# EAGLE design R6DroneElectronics (EAGLE 9.7.0)
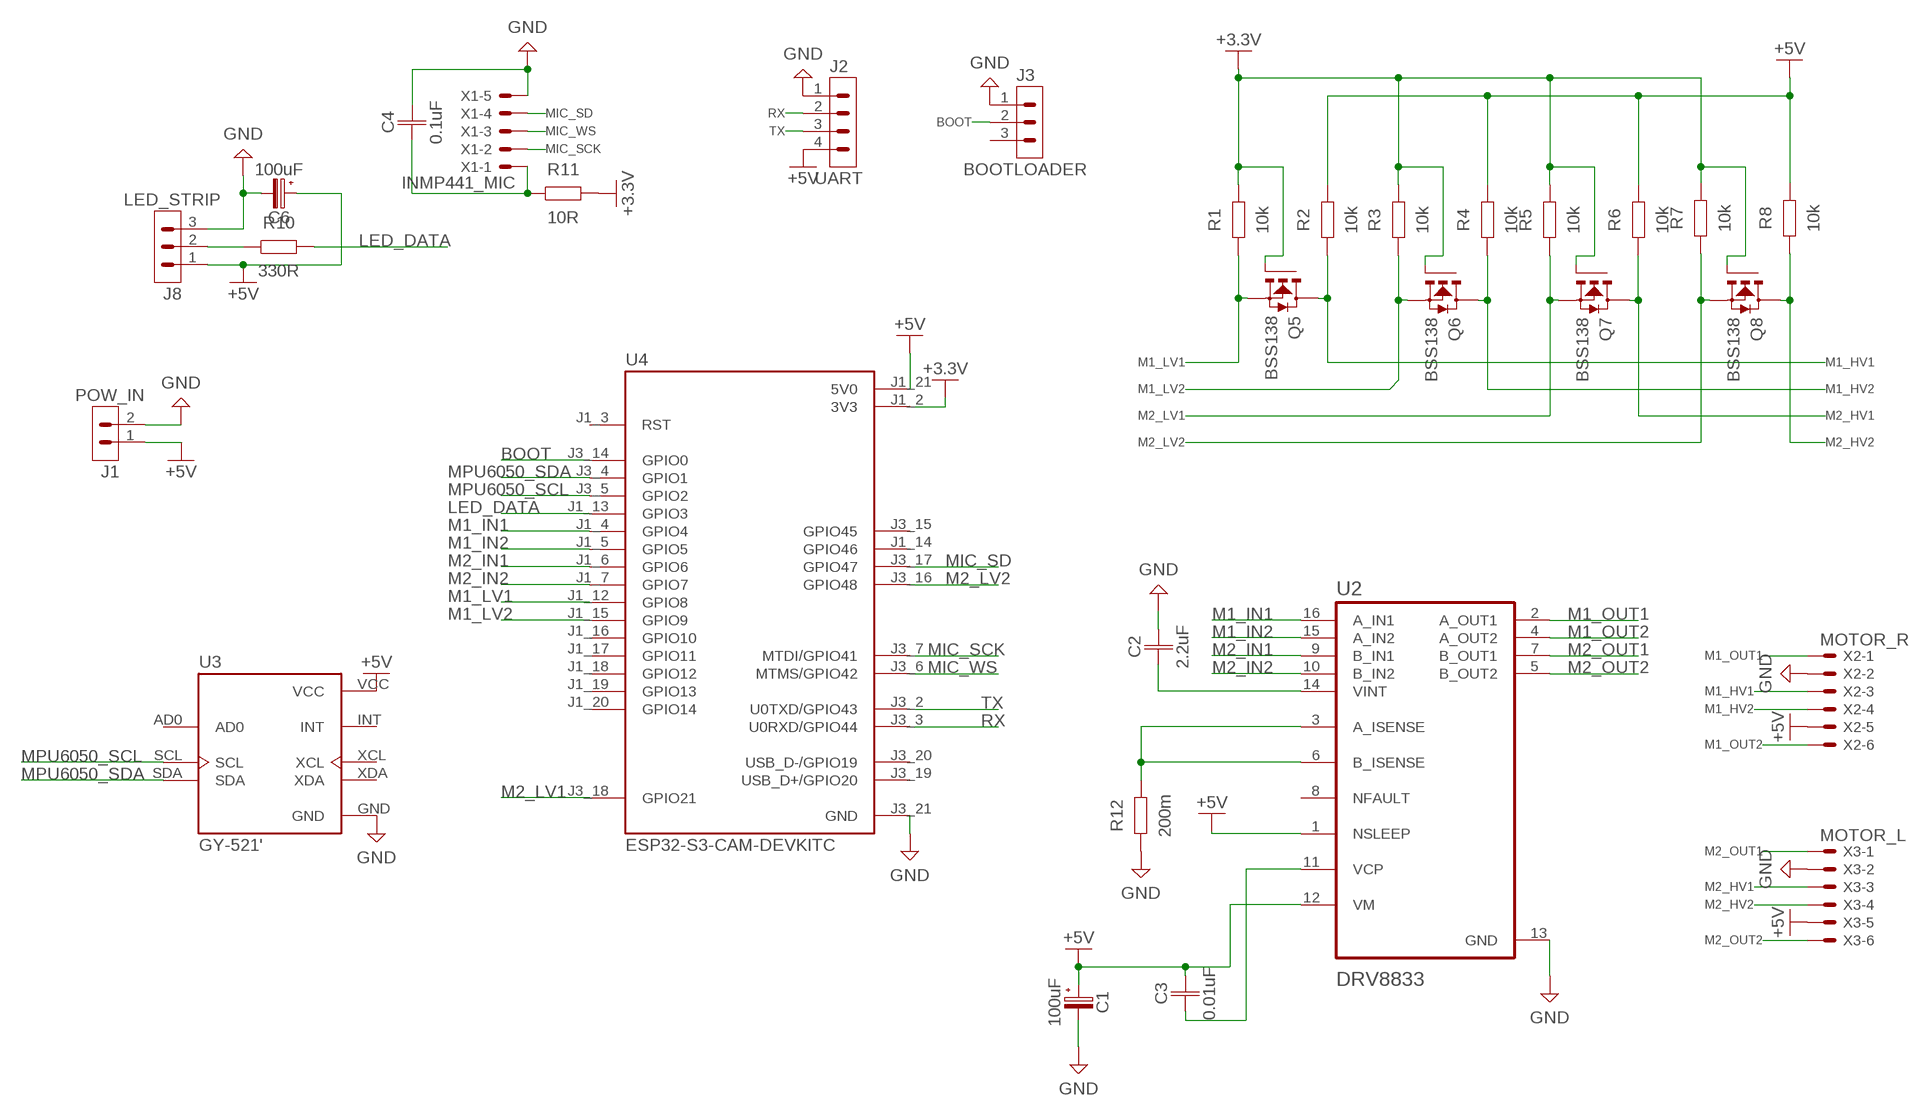
[diagram p0: schematic, sheet 1]

## Parts
C1  100uF  C-POL_ECAP-10.5MM  [CAPAE1030X1050N]
C2  2.2uF  C_CHIP-1812(4532-METRIC)  [CAPC4532X135]
C3  0.01uF  C_CHIP-1812(4532-METRIC)  [CAPC4532X135]
C4  0.1uF  C_CHIP-1812(4532-METRIC)  [CAPC4532X135]
C6  100uF  C-POL_ECAP-10.5MM  [CAPAE1030X1050N]
J1  POW_IN  B2B-XH-A  [B2B-XH-A]
J2  UART  B4B-XH-A  [B4B-XH-A]
J3  BOOTLOADER  B3B-XH-A  [B3B-XH-A]
J8  LED_STRIP  B3B-XH-A  [B3B-XH-A]
Q5  BSS138  NMOSFET_BSS123_SOT23-GSD  [SOT23]
Q6  BSS138  NMOSFET_BSS123_SOT23-GSD  [SOT23]
Q7  BSS138  NMOSFET_BSS123_SOT23-GSD  [SOT23]
Q8  BSS138  NMOSFET_BSS123_SOT23-GSD  [SOT23]
R1  10k  R_CHIP-1210(3225-METRIC)  [RESC3224X71]
R2  10k  R_CHIP-1210(3225-METRIC)  [RESC3224X71]
R3  10k  R_CHIP-1210(3225-METRIC)  [RESC3224X71]
R4  10k  R_CHIP-1210(3225-METRIC)  [RESC3224X71]
R5  10k  R_CHIP-1210(3225-METRIC)  [RESC3224X71]
R6  10k  R_CHIP-1210(3225-METRIC)  [RESC3224X71]
R7  10k  R_CHIP-1210(3225-METRIC)  [RESC3224X71]
R8  10k  R_CHIP-1210(3225-METRIC)  [RESC3224X71]
R10  330R  R_CHIP-1210(3225-METRIC)  [RESC3224X71]
R11  10R  R_CHIP-1210(3225-METRIC)  [RESC3224X71]
R12  200m  R_CHIP-1210(3225-METRIC)  [RESC3224X71]
U2  DRV8833  DRV8833PW  [SOP65P640X120-16N]
U3  GY-521'  [MODULE_GY-521]
U4  ESP32-S3-CAM-DEVKITC  [ESP32-S3-CAM-DEVKITC]
X1  INMP441_MIC  JST-XH-05-PIN-LONG-PAD  [JST-XH-05-PACKAGE-LONG-PAD]
X2  MOTOR_R  JST-XH-06-PIN-LONG-PAD  [JST-XH-06-PACKAGE-LONG-PAD]
X3  MOTOR_L  JST-XH-06-PIN-LONG-PAD  [JST-XH-06-PACKAGE-LONG-PAD]

## Nets
+3.3V: Q5.1(G) Q6.1(G) Q7.1(G) Q8.1(G) R1.2 R3.2 R5.2 R7.2 R11.2 U4.J1_2(3V3)
+5V: C1.1(+) C3.2 C6.1(+) J1.1 J2.4 J8.1 R2.2 R4.2 R6.2 R8.2 U2.1(NSLEEP) U2.12(VM) U3.VCC U4.J1_21(5V0) X2.5 X3.5
BOOT: J3.2 U4.J3_14(GPIO0)
GND: C1.2(-) C2.2 C4.2 C6.2(-) J1.2 J2.1 J3.1 J8.3 R12.1 U2.13(GND) U3.GND U4.J3_21(GND) X1.5 X2.2 X3.2
LED_DATA: R10.2 U4.J1_13(GPIO3)
M1_HV1: Q5.3(D) R2.1 X2.3
M1_HV2: Q6.3(D) R4.1 X2.4
M1_IN1: U2.16(A_IN1) U4.J1_4(GPIO4)
M1_IN2: U2.15(A_IN2) U4.J1_5(GPIO5)
M1_LV1: Q5.2(S) R1.1 U4.J1_12(GPIO8)
M1_LV2: Q6.2(S) R3.1 U4.J1_15(GPIO9)
M1_OUT1: U2.2(A_OUT1) X2.1
M1_OUT2: U2.4(A_OUT2) X2.6
M2_HV1: Q7.3(D) R6.1 X3.3
M2_HV2: Q8.3(D) R8.1 X3.4
M2_IN1: U2.9(B_IN1) U4.J1_6(GPIO6)
M2_IN2: U2.10(B_IN2) U4.J1_7(GPIO7)
M2_LV1: Q7.2(S) R5.1 U4.J3_18(GPIO21)
M2_LV2: Q8.2(S) R7.1 U4.J3_16(GPIO48)
M2_OUT1: U2.7(B_OUT1) X3.1
M2_OUT2: U2.5(B_OUT2) X3.6
MIC_SCK: U4.J3_7(MTDI/GPIO41) X1.2
MIC_SD: U4.J3_17(GPIO47) X1.4
MIC_WS: U4.J3_6(MTMS/GPIO42) X1.3
MPU6050_SCL: U3.SCL U4.J3_5(GPIO2)
MPU6050_SDA: U3.SDA U4.J3_4(GPIO1)
N$1: J8.2 R10.1
N$2: C2.1 U2.14(VINT)
N$3: R12.2 U2.3(A_ISENSE) U2.6(B_ISENSE)
N$5: C3.1 U2.11(VCP)
N$27: C4.1 R11.1 X1.1
RX: J2.2 U4.J3_3(U0RXD/GPIO44)
TX: J2.3 U4.J3_2(U0TXD/GPIO43)
Unconnected: J3.3 U2.8(NFAULT) U3.AD0 U3.INT U3.XCL U3.XDA U4.J1_3(RST) U4.J1_14(GPIO46) U4.J1_16(GPIO10) U4.J1_17(GPIO11) U4.J1_18(GPIO12) U4.J1_19(GPIO13) U4.J1_20(GPIO14) U4.J3_15(GPIO45) U4.J3_19(USB_D+/GPIO20) U4.J3_20(USB_D-/GPIO19)

## Library data of the parts
C1 C6 = Capacitor:C-POL: Capacitor Polarised - Generic; CATEGORY_L1: Capacitor; CATEGORY_L2: Aluminum Electrolytic Capacitors; CATEGORY_L3: Radial Can; PACKAGE: Surface Mount; PACKAGE_SIZE: 10.5MM
C2-C4 = Capacitor:C: Capacitor - Generic; CATEGORY_L1: Capacitor; CATEGORY_L2: Ceramic Capacitors; CATEGORY_L3: MLCC; PACKAGE: Surface Mount; PACKAGE_SIZE: 1812
J1 = Connector:B2B-XH-A: XH Connector Top Entry - 2POS; CATEGORY_L1: Connectors; CATEGORY_L2: Rectangular Connectors; CATEGORY_L3: Male Headers; DATASHEET: https://www.jst-mfg.com/product/pdf/eng/eXH.pdf; DESCRIPTION: Connector Header Through Hole 2 position 0.098" (2.50mm); MANUFACTURER: JST Sales America Inc.; MPN: B2B-XH-A; OPERATING_TEMPERATURE: -25°C ~ 85°C; PACKAGE: Through Hole; PACKAGE_SIZE: NA; PART_STATUS: Active; PITCH: 0.098" (2.50mm); ROHS: Compliant; SERIES: XH
J2 = Connector:B4B-XH-A: XH Connector Top Entry - 4POS; CATEGORY_L1: Connectors; CATEGORY_L2: Rectangular Connectors; CATEGORY_L3: Male Headers; DATASHEET: https://www.jst-mfg.com/product/pdf/eng/eXH.pdf; DESCRIPTION: Connector Header Through Hole 4 position 0.098" (2.50mm); MANUFACTURER: JST Sales America Inc.; MPN: B4B-XH-A; OPERATING_TEMPERATURE: -25°C ~ 85°C; PACKAGE: Through Hole; PACKAGE_SIZE: NA; PART_STATUS: Active; PITCH: 0.098" (2.50mm); ROHS: Compliant; SERIES: XH
J3 J8 = Connector:B3B-XH-A: XH Connector Top Entry - 3POS; CATEGORY_L1: Connectors; CATEGORY_L2: Rectangular Connectors; CATEGORY_L3: Male Headers; DATASHEET: https://www.jst-mfg.com/product/pdf/eng/eXH.pdf; DESCRIPTION: Connector Header Through Hole 3 position 0.098" (2.50mm); MANUFACTURER: JST Sales America Inc.; MPN: B3B-XH-A; OPERATING_TEMPERATURE: -25°C ~ 85°C; PACKAGE: Through Hole; PACKAGE_SIZE: NA; PART_STATUS: Active; PITCH: 0.098" (2.50mm); ROHS: Compliant; SERIES: XH
Q5-Q8 = Transistor:NMOSFET_: N-Channel MOSFET - Popular parts; CATEGORY_L1: Transistor; CATEGORY_L2: MOSFET; CATEGORY_L3: N-Channel; DATASHEET: https://www.onsemi.com/download/data-sheet/pdf/bss123l-d.pdf; DESCRIPTION: N-Channel 100 V 170mA (Ta) 360mW (Ta) Surface Mount SOT-23-3; DRAIN_CURRENT: 170 mA; IC_MAX: NA; MANUFACTURER: onsemi; MPN: BSS123L; OPERATING_TEMPERATURE: -55°C ~ 150°C; PACKAGE: Surface Mount; PACKAGE_SIZE: SOT-23-3; PART_STATUS: Active; ROHS: Compliant; SERIES: BSS123; THERMALLOSS: 0.36 W; VCEO_MAX: NA
R1-R8 R10-R12 = Resistor:R: Resistor Fixed - Generic; CATEGORY_L1: Resistors; DESCRIPTION: Chip Resistor 3.20 X 2.49 X 0.71 mm body 1210(3225-METRIC) Package; PACKAGE: Surface Mount; PACKAGE_SIZE: 1210
U2 = DRV8833:DRV8833PW; CHECK_PRICES: https://www.snapeda.com/parts/DRV8833PW/Texas+Instruments/view-part/?ref=eda; DESCRIPTION: 10.8-V, 2-A dual H-bridge motor driver with current regulation; DIGIKEY_PART_NUMBER: DRV8833PW-ND; MF: Texas Instruments; MP: DRV8833PW; PACKAGE: TSSOP-16 Texas Instruments; SNAPEDA_LINK: https://www.snapeda.com/parts/DRV8833PW/Texas+Instruments/view-part/?ref=snap
U3 = GY-521:GY-521; AVAILABILITY: Not in stock; CHECK_PRICES: https://www.snapeda.com/parts/GY-521/GODREAM+FORDREAM+CO.%252C+LIMITED/view-part/?ref=eda; DESCRIPTION: Triple Axis Accelerometer Gyro Breakout; MF: GODREAM FORDREAM CO., LIMITED; MP: GY-521; PACKAGE: Package; PRICE: None; SNAPEDA_LINK: https://www.snapeda.com/parts/GY-521/GODREAM+FORDREAM+CO.%252C+LIMITED/view-part/?ref=snap
U4 = ESP32-S3-CAM-DEVKITC:ESP32-S3-CAM-DEVKITC; AVAILABILITY: In Stock; CHECK_PRICES: https://www.snapeda.com/parts/ESP32-S3-DEVKITC-1-N8R2/Espressif+Systems/view-part/?ref=eda; DESCRIPTION: WiFi Development Tools - 802.11 ESP32-S3 general-purpose development board, embeds ESP32-S3-WROOM-1-N8R2, with pin header; MF: Espressif Systems; MP: ESP32-S3-DEVKITC-1-N8R2; PACKAGE: None; PRICE: None; SNAPEDA_LINK: https://www.snapeda.com/parts/ESP32-S3-DEVKITC-1-N8R2/Espressif+Systems/view-part/?ref=snap
X1 = Rembrandt Electronics - JST XH Connectors v1-0:JST-XH-05-PIN: JST XH Connector 2 Pin Wire to board connector. Pitch: 2,54 mm, (0.100") Number of pins: 5 Created by Rembrandt Electronics www.rembrandtelectronics.com
X2 X3 = Rembrandt Electronics - JST XH Connectors v1-0:JST-XH-06-PIN: JST XH Connector 2 Pin Wire to board connector. Pitch: 2,54 mm, (0.100") Number of pins: 6 Created by Rembrandt Electronics www.rembrandtelectronics.com

## Board
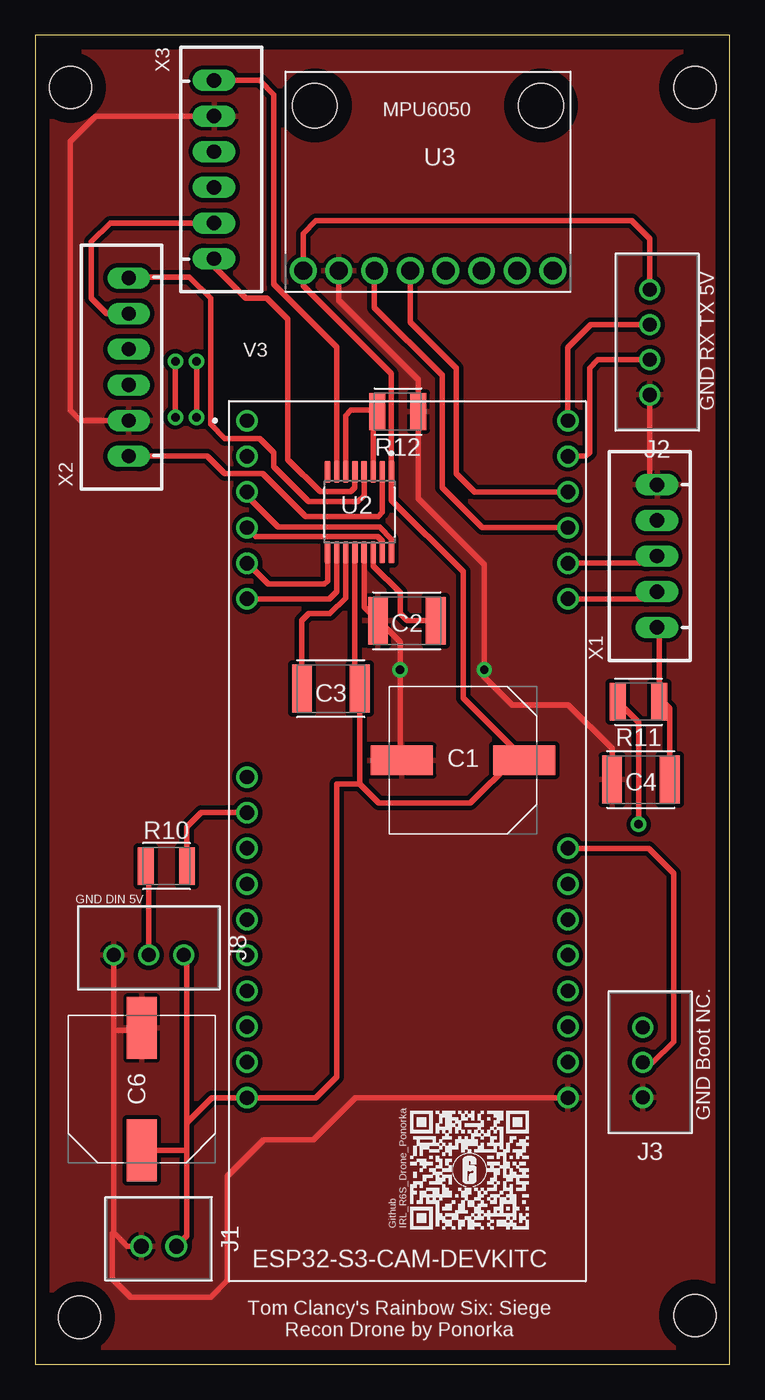
[diagram p1: board, top side]
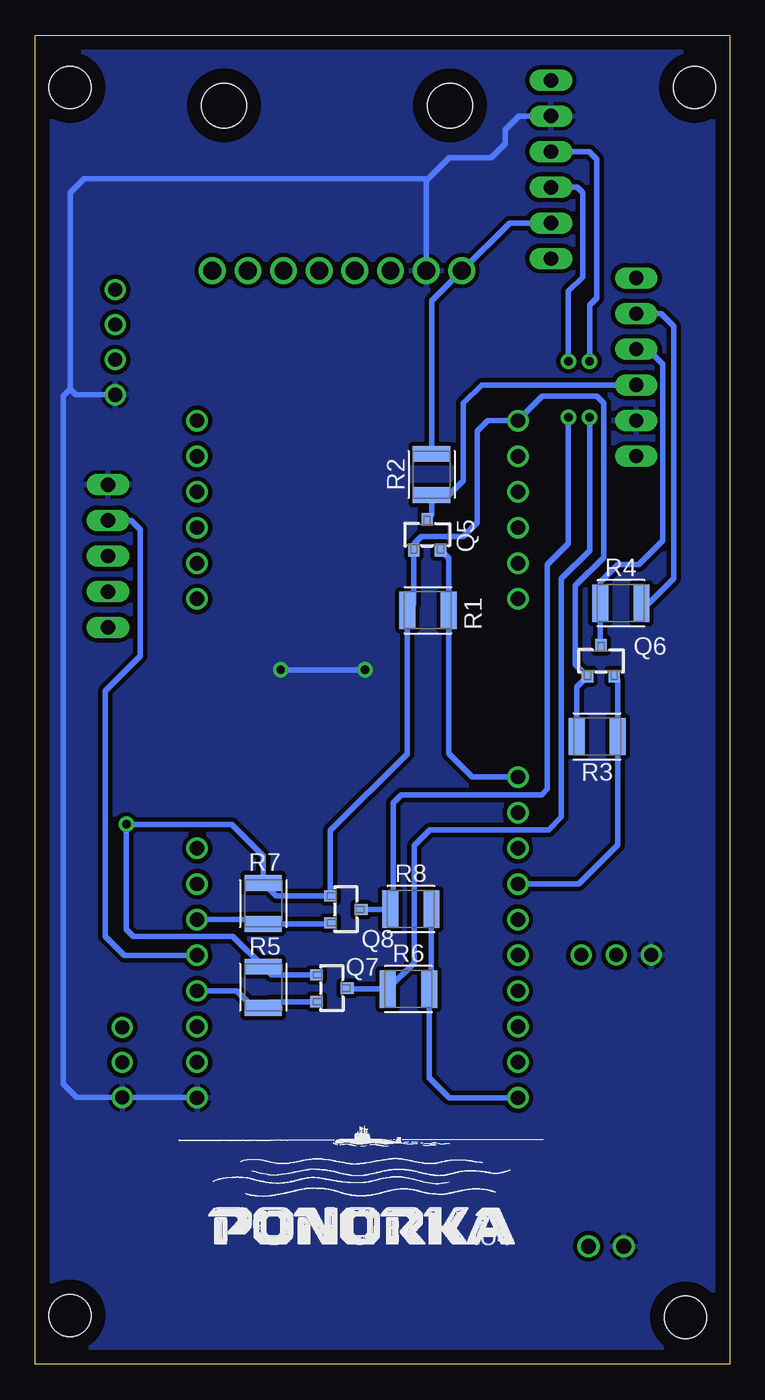
[diagram p2: board, bottom side, seen from below]

Size 49.5 x 94.74 mm. Coordinates in mm from the lower left corner, seen from the top.
Outline: 0,0 49.5,0 49.5,94.74 0,94.74 0,0
Copper layers (1*16): Top 0.035mm / dielectric 1.5mm / Bottom 0.035mm
Design rules "Fusion Electronics Design Rules": minimum track width 6mil, minimum drill 0.35mm, track to track 6mil, track to pad 6mil, pad to pad 6mil, via to via 6mil, smd to smd 6mil, copper to edge 40mil, drill to drill 6mil, minimum pad ring 10mil, minimum via ring 8mil, stop-mask expansion 4mil, vias tented up to drill 9999mil, thermal gap 10mil
Holes 3 mm at 2.52,91 47,91 3.18,3.36 47,3.5

### Footprints (pad centres in the part's own frame; a part is rotated, then mirrored left to right if it is on the bottom)
CAPAE1030X1050N = smd 4.416 x 2.115: 1 -4.353,0; 2 4.353,0
CAPC4532X135 = smd 1.397 x 3.415: 1 -2.057,0; 2 2.057,0
B2B-XH-A = drill 1.05: 1 0.525,1.27; 2 0.525,-1.23
B4B-XH-A = drill 1: 1 0.525,3.75; 2 0.525,1.25; 3 0.525,-1.25; 4 0.525,-3.75
B3B-XH-A = drill 1: 1 0.525,2.5; 2 0.525,0; 3 0.525,-2.5
SOT23 = smd 0.8 x 0.9: 1 -0.96,-1.1; 2 0.96,-1.1; 3 0,1.1
RESC3224X71 = smd 1.131 x 2.66: 1 -1.47,0; 2 1.47,0
SOP65P640X120-16N = smd 1.57 x 0.41: 1 -2.87,2.275; 2 -2.87,1.625; 3 -2.87,0.975; 4 -2.87,0.325; 5 -2.87,-0.325; 6 -2.87,-0.975; 7 -2.87,-1.625; 8 -2.87,-2.275; 9 2.87,-2.275; 10 2.87,-1.625; 11 2.87,-0.975; 12 2.87,-0.325; 13 2.87,0.325; 14 2.87,0.975; 15 2.87,1.625; 16 2.87,2.275
MODULE_GY-521 = drill 1.27: AD0 -6.33,-6.35; GND -6.33,6.35; INT -6.33,-8.89; SCL -6.33,3.81; SDA -6.33,1.27; VCC -6.33,8.89; XCL -6.33,-3.81; XDA -6.33,-1.27 | hole 3.2: 5.43,8.06; 5.43,-8.06
ESP32-S3-CAM-DEVKITC = drill 1.02: J1_2 -11.43,29.97; J1_3 -11.43,27.43; J1_4 -11.43,24.89; J1_5 -11.43,22.35; J1_6 -11.43,19.81; J1_7 -11.43,17.27; J1_12 -11.43,4.57; J1_13 -11.43,2.03; J1_14 -11.43,-0.51; J1_15 -11.43,-3.05; J1_16 -11.43,-5.59; J1_17 -11.43,-8.13; J1_18 -11.43,-10.67; J1_19 -11.43,-13.21; J1_20 -11.43,-15.75; J1_21 -11.43,-18.29; J3_2 11.43,29.97; J3_3 11.43,27.43; J3_4 11.43,24.89; J3_5 11.43,22.35; J3_6 11.43,19.81; J3_7 11.43,17.27; J3_14 11.43,-0.51; J3_15 11.43,-3.05; J3_16 11.43,-5.59; J3_17 11.43,-8.13; J3_18 11.43,-10.67; J3_19 11.43,-13.21; J3_20 11.43,-15.75; J3_21 11.43,-18.29
JST-XH-05-PACKAGE-LONG-PAD = drill 1.016 long: 1 -5.08,0; 2 -2.54,0; 3 0,0; 4 2.54,0; 5 5.08,0
JST-XH-06-PACKAGE-LONG-PAD = drill 1.016 long: 1 -6.35,0; 2 -3.81,0; 3 -1.27,0; 4 1.27,0; 5 3.81,0; 6 6.35,0

### Placement (x,y rotation side)
C1  30.48,43.05 180 top
C2  26.48,53 180 top
C3  21.07,48.16 0 top
C4  43.16,41.68 180 top
C6  7.6,19.62 90 top
J1  8.8,8.95 270 top
J2  44.31,72.85 180 top
J3  43.81,21.52 180 top
J8  8.1,29.7 270 top
Q5  21.57,59.14 0 bottom
Q6  9.19,50.14 0 bottom
Q7  28.36,26.81 270 bottom
Q8  27.36,32.43 270 bottom
R1  21.51,53.75 180 bottom
R2  21.25,63.43 90 bottom
R3  9.45,44.75 180 bottom
R4  7.77,54.25 0 bottom
R5  33.25,26.88 90 bottom
R6  22.9,26.75 0 bottom
R7  33.25,32.85 90 bottom
R8  22.73,32.45 0 bottom
R10  9.35,35.52 0 top
R11  42.99,47.23 180 top
R12  25.84,67.91 180 top
U2  23.11,60.74 270 top
U3  27.99,84.28 90 top
U4  26.53,37.29 0 top
X1  44.31,57.61 90 top
X2  6.67,71.08 90 top
X3  12.75,85.16 270 top

### Tracks (layer width: path | path; a pad name or v marks a point on that pad's centre or on a via)
+3.3V  (via drill 0.6 pad 1.1)
  Top 0.406: v43,38.5 43,45.75 R11.2
  Bottom 0.406: R3.2 10.92,48.27 Q6.1 11,49.89 11,55.5 9,57.5 9,68.5 9.5,69 13.36,69 U4.J1_2 17.24,67.26 18,66.5 18,60 19,59 22,59 22.5,58.5 22.5,58.07 Q5.1 22.53,54.2 R1.2 22.98,43.52 28.46,38.04 Q8.1 32.32,33.39 R7.2 33.25,36.25 35.5,38.5 v43,38.5 43,31 42.5,30.5 35.4,30.5 R5.2 32.67,27.77 Q7.1
+5V
  Top 0.406: U2.12 22.78,48.5 C3.2 23.13,41.37 | 23.13,41.37 24.5,40 31,40 34.05,43.05 C1.1 34.84,43.16 30.5,47.5 30.5,56.5 25.38,61.62 U2.1 25.38,70.61 19.1,76.9 U3.VCC 19.1,80.6 20,81.5 42.5,81.5 43.78,80.22 J2.4 | X2.5 5.11,74.89 4,76 4,80 5.35,81.35 X3.5 | 23.13,41.37 21.5,41.37 21.5,20.5 20,19 U4.J1_21 12.6,19 10.8,17.2 | J1.1 10.8,9.15 10.8,15.3 | 10.8,15.3 10.8,17.2 | C6.1 10.77,15.27 10.8,15.3 | J8.1 10.8,28.98 10.8,17.2
  Bottom 0.406: X3.5 15.7,81.35 U3.VCC 21.25,75.8 R2.2 | R4.2 5.75,54.25 4,56 4,74 4.89,74.89 X2.5 | R8.2 21.26,26.92 R6.2 21.43,20.43 20,19 U4.J1_21
BOOT
  Top 0.406: J3.2 44.02,21.52 45.5,23 45.5,35 43.72,36.78 U4.J3_14
GND  (via drill 0.6 pad 1.1)
  Top 0.406: U2.13 23.44,53.99 C2.2 24.5,53 26,51.5 v26,49.5 26,43.18 C1.2 | X2.2 3.23,67.27 2.5,68 2.5,87.14 4.33,88.97 X3.2 | J2.1 43.78,63.22 X1.5 | U3.GND 21.64,75.86 27.31,70.19 R12.1 27.31,61.69 32,57 v32,49.5 32,49 34,47 38,47 41.1,43.9 C4.2 | J8.3 5.6,23.8 | 5.6,23.8 5.6,9.4 | 5.6,9.4 6.57,8.43 J1.2 | C6.2 7.42,23.8 5.6,23.8 | U4.J3_21 22.8,19 19.8,16 16.3,16 13.7,13.4 13.7,6 12.5,4.8 6.8,4.8 5.5,6.1 5.5,9.3 5.6,9.4
  Bottom 0.406: U4.J3_21 37.98,19.02 J3.1 46.52,19.02 47.5,20 47.5,69 47,69.5 | U3.GND 21.64,84.36 | 21.64,84.36 20,86 17,86 16,87 16,88 15.03,88.97 X3.2 | J2.1 46.6,69.1 47,69.5 | 47,69.5 47,83.5 46,84.5 21.78,84.5 21.64,84.36 | v26,49.5 v32,49.5
  pour Top (isolate 0.305): 0.2,0.2 49.3,0.2 49.3,94.3 49.1,94.5 0.2,94.5
  pour Bottom (isolate 0.305): 0.4,0.2 49.3,0.2 49.3,94.5 0.2,94.5 0.2,0.4
LED_DATA
  Top 0.406: R10.2 10.82,38.32 11.82,39.32 U4.J1_13
M1_HV1
  Bottom 0.406: Q5.3 21.25,60.56 R2.1 20.04,61.96 19,63 19,68.5 17.69,69.81 X2.3
M1_HV2
  Bottom 0.406: Q6.3 9.24,51.29 R4.1 9.24,55.76 8,57 6.5,57 4.79,58.71 4.79,71.29 5.85,72.35 X2.4
M1_IN1
  Top 0.406: U4.J1_4 15.1,61.9 17.33,59.67 24.54,59.67 25.38,58.82 U2.16
M1_IN2
  Top 0.406: U4.J1_5 15.73,59.01 24.41,59.01 24.73,58.68 U2.15
M1_LV1
  Bottom 0.406: U4.J1_12 18.36,41.86 20.04,43.54 R1.1 20.04,57.47 Q5.2
M1_LV2
  Bottom 0.406: U4.J1_15 10.76,34.24 7.98,37.02 R3.1 7.98,48.79 Q6.2
M1_OUT1
  Top 0.406: X2.1 12.27,64.73 13.5,63.5 16.21,63.5 19.27,60.44 24.44,60.44 24.73,60.73 U2.2
M1_OUT2
  Top 0.406: U2.4 23.44,61.94 23,61.5 19.5,61.5 17,64 17,65 16,66 13.5,66 12.5,67 12.5,76 11,77.5 6.74,77.5 X2.6
M2_HV1  (via drill 0.6 pad 1.1)
  Top 0.406: v10,67.5 v10,71.5
  Bottom 0.406: Q7.3 27.2,26.75 R6.1 22.5,28.62 22.5,37 21.4,38.1 12.9,38.1 12,39 12,56 10,58 v10,67.5 | X3.3 10.03,86.43 9.5,85.9 9.5,76 10,75.5 v10,71.5
M2_HV2  (via drill 0.6 pad 1.1)
  Top 0.406: v11.5,67.5 v11.5,71.5
  Bottom 0.406: Q8.3 24.22,32.43 R8.1 24,32.65 24,40 23.4,40.6 13.4,40.6 13,41 13,57 11.5,58.5 v11.5,67.5 | X3.4 10.89,83.89 10.5,83.5 10.5,77.5 11.5,76.5 v11.5,71.5
M2_IN1
  Top 0.406: U2.9 20.84,55.84 20.6,55.6 16.6,55.6 U4.J1_6
M2_IN2
  Top 0.406: U2.10 21.48,55.09 20.96,54.56 U4.J1_7
M2_LV1
  Bottom 0.406: Q7.2 32.81,25.85 R5.1 33.91,25.41 35.12,26.62 U4.J3_18
M2_LV2
  Bottom 0.406: U4.J3_16 33.57,31.7 R7.1 28.55,31.38 Q8.2
M2_OUT1
  Top 0.406: U2.7 21.48,69.08 21.5,69.1 21.5,72.5 17,77 17,90.5 15.99,91.51 X3.1
M2_OUT2
  Top 0.406: U2.5 22.78,62.48 22.5,62.2 20.3,62.2 18,64.5 18,74.5 16.5,76 15,76 12.75,78.25 X3.6
MIC_SCK
  Top 0.406: U4.J3_7 43.8,54.56 X1.2
MIC_SD
  Bottom 0.406: X1.4 42.65,60.15 42,59.5 42,50.5 44.5,48 44.5,30.5 43.16,29.16 U4.J3_17
MIC_WS
  Top 0.406: U4.J3_6 43.8,57.1 X1.3
MPU6050_SCL
  Top 0.406: U4.J3_5 31.86,59.64 29,62.5 29,70.5 24.18,75.32 U3.SCL
MPU6050_SDA
  Top 0.406: U3.SDA 26.72,74.28 30,71 30,63.5 31.32,62.18 U4.J3_4
N$1
  Top 0.406: J8.2 8.1,35.3 R10.1
N$2
  Top 0.406: U2.14 24.09,56.91 26,55 26,53.5 26.5,53 C2.1
N$3
  Top 0.406: U2.3 24.09,67.62 R12.2 24.28,68 22.5,68 22.13,67.64 U2.6
N$5
  Top 0.406: U2.11 22.13,54.63 21,53.5 19.5,53.5 19.01,53.01 C3.1
N$27
  Top 0.406: R11.1 44.46,47.5 | 44.46,47.5 44.46,52.38 X1.1 | C4.1 45.22,46.74 44.46,47.5
RX
  Top 0.406: U4.J3_3 39.22,64.72 39.5,65 39.5,71 40.1,71.6 J2.2
TX
  Top 0.406: U4.J3_2 37.96,72.46 39.6,74.1 J2.3

### Text on the board
tPlace: MPU6050 | V3 | GND RX TX 5V | GND DIN 5V | GND Boot NC. | Github / IRL_R6S_Drone_Ponorka | ESP32-S3-CAM-DEVKITC | Tom Clancy's Rainbow Six: Siege / Recon Drone by Ponorka